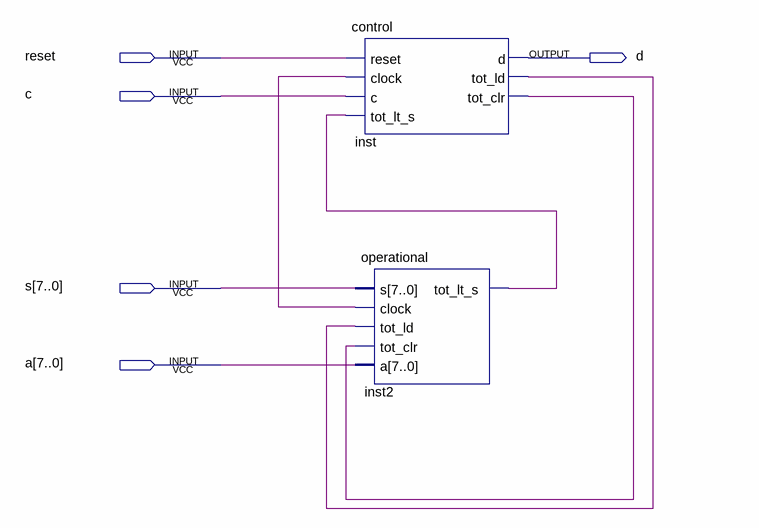
[diagram p0: schematic sheet]
// Quartus schematic vending_machine.bdf as structural Verilog: 2 symbols, 5 pins
module vending_machine (
  input  reset,
  input  c,
  input  [7:0] s,
  input  [7:0] a,
  output d
);

  wire inst2_tot_lt_s, inst_tot_clr, inst_tot_ld, undriven;

  control inst (
    .reset(reset), .clock(undriven), .c(c), .tot_lt_s(inst2_tot_lt_s), .d(d), .tot_ld(inst_tot_ld),
    .tot_clr(inst_tot_clr));
  operational inst2 (
    .s(s), .clock(undriven), .tot_ld(inst_tot_ld), .tot_clr(inst_tot_clr), .a(a), .tot_lt_s(inst2_tot_lt_s));
endmodule
